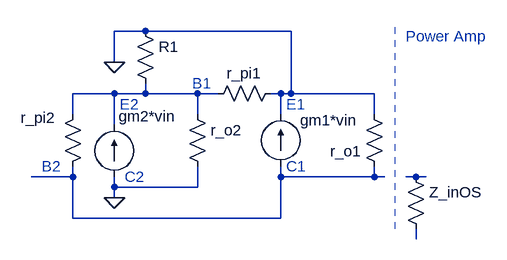
[diagram p0: schematic vas_stage.asc]
vas_stage.asc, the LTspice schematic file:
Version 4
SHEET 1 880 680
WIRE 224 -32 176 -32
WIRE 448 -32 224 -32
WIRE 176 16 176 -32
WIRE 176 64 112 64
WIRE 224 64 224 48
WIRE 224 64 176 64
WIRE 304 64 224 64
WIRE 336 64 304 64
WIRE 432 64 416 64
WIRE 448 64 448 -32
WIRE 448 64 432 64
WIRE 576 64 448 64
WIRE 112 96 112 64
WIRE 304 96 304 64
WIRE 432 96 432 64
WIRE 576 96 576 64
WIRE 176 112 176 64
WIRE 112 192 112 176
WIRE 112 192 48 192
WIRE 432 192 432 176
WIRE 576 192 576 176
WIRE 576 192 432 192
WIRE 592 192 576 192
WIRE 640 192 624 192
WIRE 656 192 640 192
WIRE 176 208 176 192
WIRE 304 208 304 176
WIRE 304 208 176 208
WIRE 176 224 176 208
WIRE 112 256 112 192
WIRE 432 256 432 192
WIRE 432 256 112 256
WIRE 640 288 640 272
FLAG 176 224 0
FLAG 176 16 0
SYMBOL res 96 192 M180
WINDOW 0 -64 91 Left 2
WINDOW 3 36 19 Left 2
SYMATTR InstName r_pi2
SYMATTR Value ""
SYMBOL current 176 192 M180
WINDOW 0 7 93 Left 2
WINDOW 3 24 -21 Left 2
SYMATTR InstName gm2*vin
SYMATTR Value ""
SYMBOL res 432 48 R90
WINDOW 0 0 56 VBottom 2
WINDOW 3 32 56 VTop 2
SYMATTR InstName r_pi1
SYMATTR Value ""
SYMBOL res 288 80 R0
SYMATTR InstName r_o2
SYMATTR Value ""
SYMBOL current 432 176 M180
WINDOW 0 30 71 Left 2
WINDOW 3 24 -21 Left 2
SYMATTR InstName gm1*vin
SYMATTR Value ""
SYMBOL res 560 80 R0
WINDOW 0 -52 73 Left 2
SYMATTR InstName r_o1
SYMATTR Value ""
SYMBOL res 208 -48 R0
SYMATTR InstName R1
SYMATTR Value ""
SYMBOL res 624 176 R0
SYMATTR InstName Z_inOS
SYMATTR Value ""
TEXT 296 48 Left 2 ;B1
TEXT 440 176 Left 2 ;C1
TEXT 184 80 Left 2 ;E2
TEXT 440 80 Left 2 ;E1
TEXT 192 192 Left 2 ;C2
TEXT 64 176 Left 2 ;B2
TEXT 624 -24 Left 2 ;Power Amp
LINE Normal 608 272 608 -48 1

The netlist it stands for:
* vas_stage.asc
r_pi2 N002 N001
I§gm2*vin 0 N001
r_pi1 0 N001
r_o2 N001 0
I§gm1*vin N002 0
r_o1 0 N002
R1 0 N001
R§Z_inOS N003 N004
* B1
* C1
* E2
* E1
* C2
* B2
* Power Amp
.backanno
.end